# EAGLE design NAQM_Node1 (EAGLE 9.5.2)
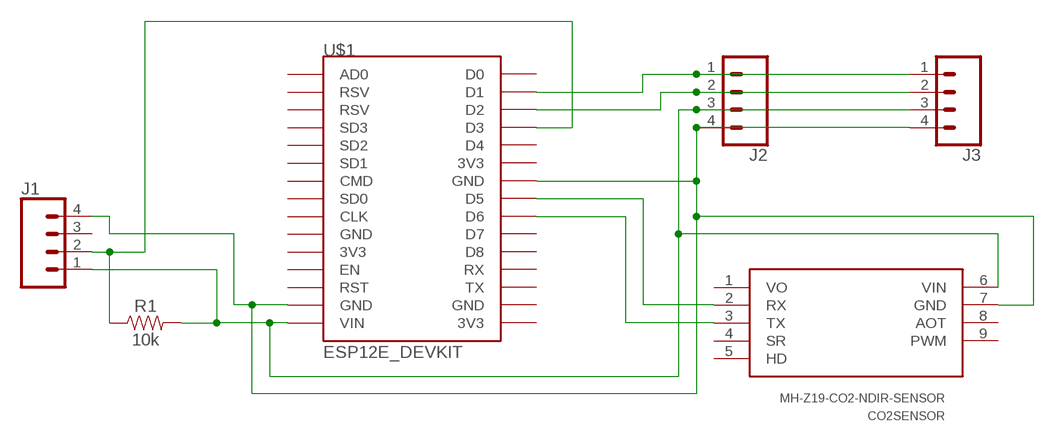
[diagram p0: schematic, sheet 1]

## Parts
CO2SENSOR  MH-Z19-CO2-NDIR-SENSOR  [MH-Z19]
J1  CONN_04PTH  [1X04]
J2  CONN_04PTH  [1X04]
J3  CONN_04PTH  [1X04]
R1  10k  10KOHM-HORIZ-1/4W-1%  [AXIAL-0.3]
U$1  ESP12E_DEVKIT  [ESP12E_DEVKIT]

## Nets
N$1: J2.1 J3.1 U$1.D1
N$2: J2.2 J3.2 U$1.D2
N$4: CO2SENSOR.6(VIN) J1.1 J2.3 J3.3 R1.P$2 U$1.VIN
N$7: J1.2 R1.P$1 U$1.D3
N$8: CO2SENSOR.2(RX) U$1.D5
N$9: CO2SENSOR.3(TX) U$1.D6
N$11: CO2SENSOR.7(GND) J1.4 J2.4 J3.4 U$1.GND@1(GND) U$1.GND@2(GND)
Unconnected: CO2SENSOR.4(SR) CO2SENSOR.5(HD) CO2SENSOR.8(AOT) CO2SENSOR.9(PWM) J1.3 U$1.3V3@0(3V3) U$1.3V3@1(3V3) U$1.3V3@2(3V3) U$1.AD0 U$1.CLK U$1.CMD U$1.D0 U$1.D4 U$1.D7 U$1.D8 U$1.EN U$1.GND@0(GND) U$1.GND@3(GND) U$1.RST U$1.RSV@0(RSV) U$1.RSV@1(RSV) U$1.RX U$1.SD0 U$1.SD1 U$1.SD2 U$1.SD3 U$1.TX

## Power pins joined to a net without a drawn wire
VO: CO2SENSOR.1(VO)

## Library data of the parts
CO2SENSOR = mh-z19:MH-Z19: MH-Z19 - CO2 NDIR SENSOR
J1-J3 = SparkFun-Connectors:CONN_04: Multi connection point. Often used as Generic Header-pin footprint for 0.1 inch spaced/style header connections On any of the 0.1 inch spaced packages, you can populate with these: Break Away Headers - Straight <https://www.sparkfun.com/products/116> (PRT-00116) Break Away Male Headers - Right Angle <https://www.sparkfun.com/products/553> (PRT-00553) Female Headers <https://www.sparkfun.com/products/115> (PRT-00115) Break Away Headers - Machine Pin <https://www.sparkfun.com/products/117> (PRT-00117) Break Away Female Headers - Swiss Machine Pin <https://www.sparkfun.com/products/743> (PRT-00743) For SCREWTERMINALS and SPRING TERMINALS visit here: Screw Terimnals on SparkFun.com <https://www.sparkfun.com/search/results?term=Screw+Terminals> (5mm/3.5mm/2.54mm spacing) This device is also useful as a general connection point to wire up your design to another part of your project. Our various solder wires solder well into these plated through hole pads. Hook-Up Wire - Assortment (Stranded, 22 AWG) <https://www.sparkfun.com/products/11375> (PRT-11375) Hook-Up Wire - Assortment (Solid Core, 22 AWG) <https://www.sparkfun.com/products/11367> (PRT-11367) View the entire wire category on our website here <https://www.sparkfun.com/categories/141> Special notes: Molex polarized connector foot print use with SKU : PRT-08231 with associated crimp pins and housings. 1MM SMD Version SKU: PRT-10208; PROD_ID: CONN-09696
R1 = SparkFun-Resistors:10KOHM: 10kΩ resistor A resistor is a passive two-terminal electrical component that implements electrical resistance as a circuit element. Resistors act to reduce current flow, and, at the same time, act to lower voltage levels within circuits. - Wikipedia; PROD_ID: RES-12183
U$1 = ESP12E_DEVKIT:ESP12E_DEVKIT: ESP12E DEVKIT BOARD

## Board
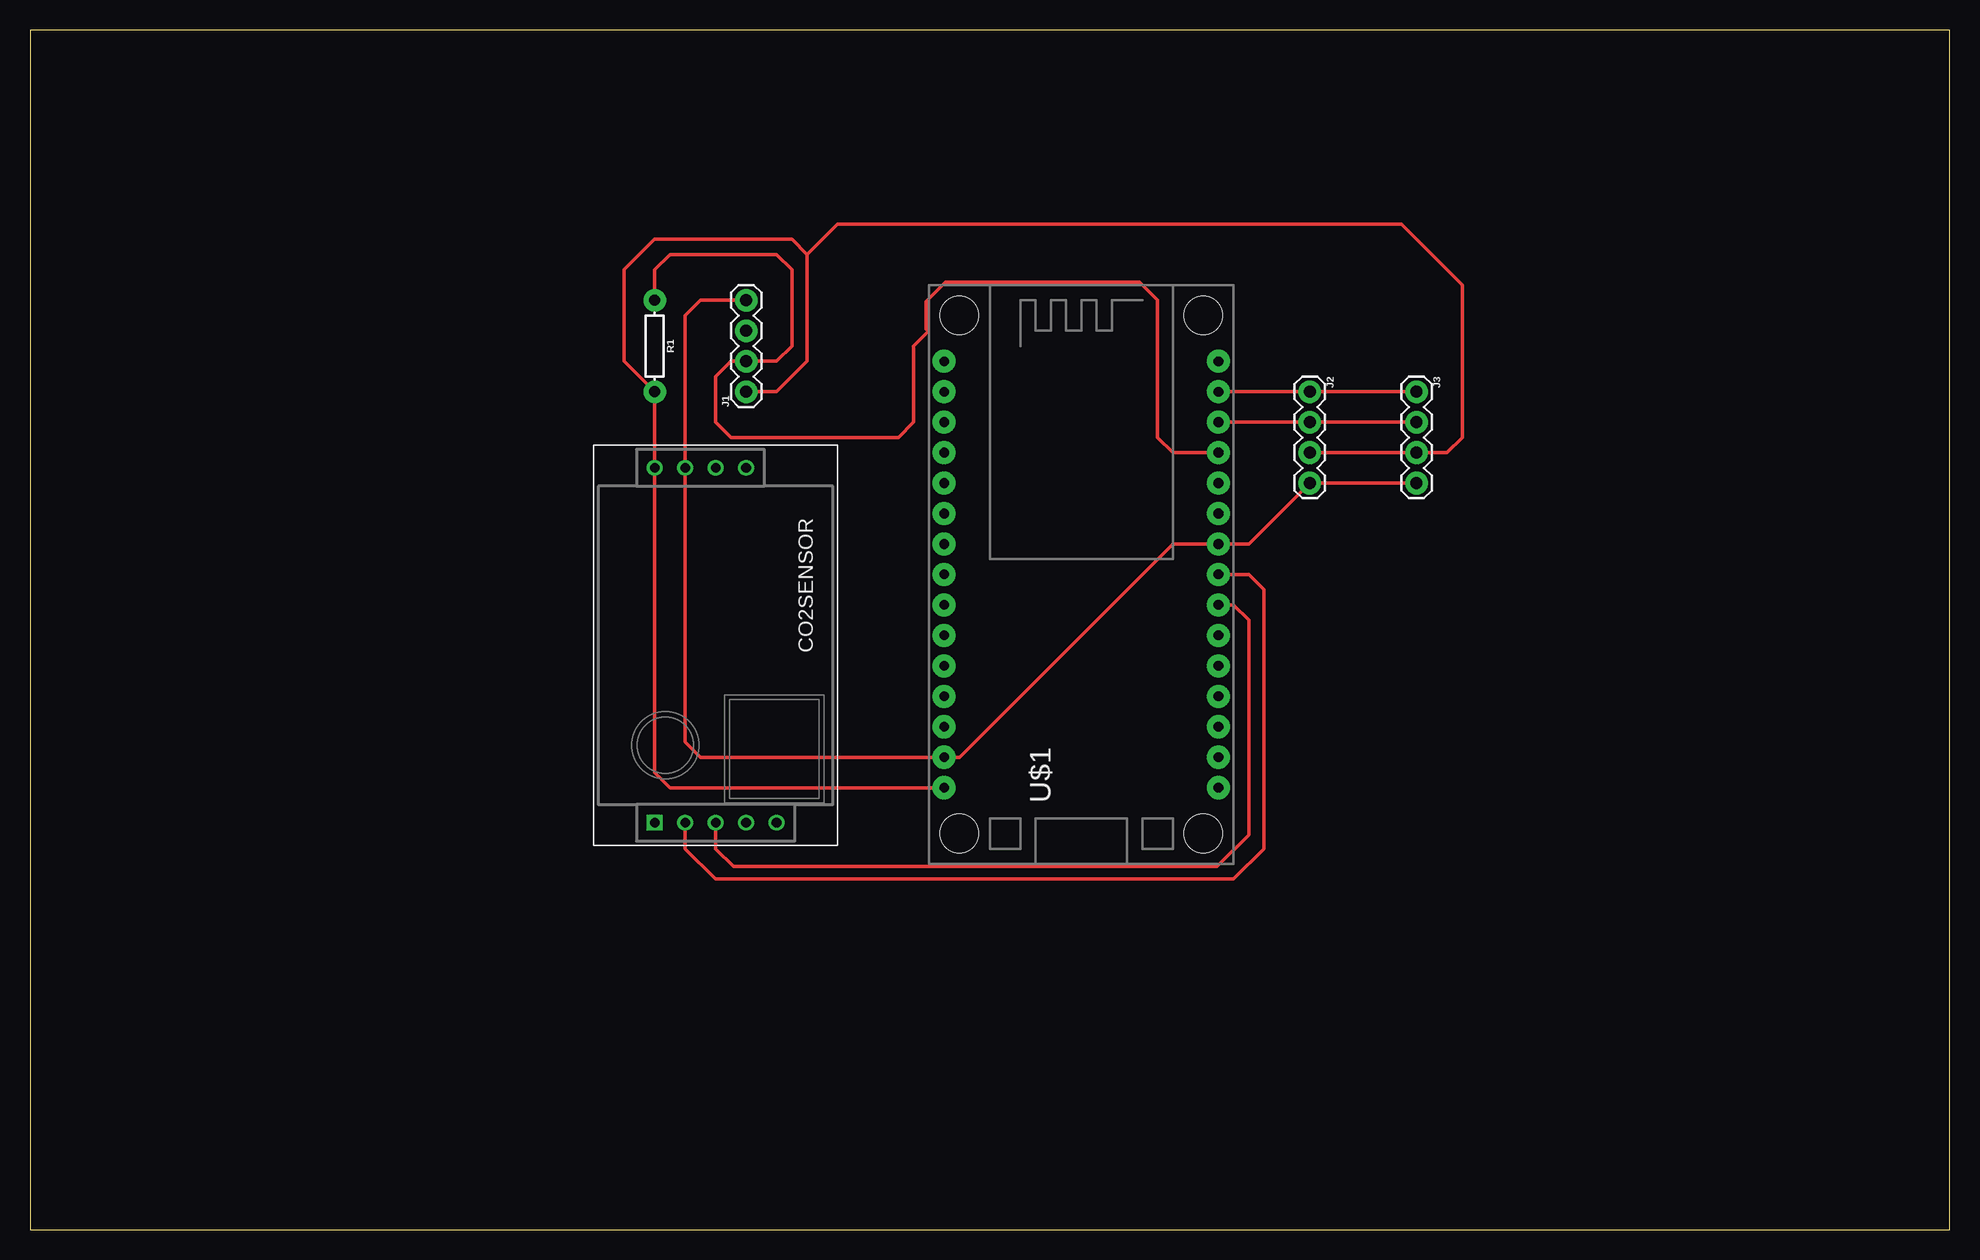
[diagram p1: board, top side]

Size 160 x 100 mm. Coordinates in mm from the lower left corner, seen from the top.
Outline: 0,0 160,0 160,100 0,100 0,0
Copper layers (1*16): Top 0.035mm / dielectric 1.5mm / Bottom 0.035mm
Design rules "default": minimum track width 6mil, minimum drill 0.35mm, track to track 6mil, track to pad 6mil, pad to pad 6mil, via to via 6mil, smd to smd 6mil, copper to edge 40mil, drill to drill 6mil, minimum pad ring 10mil, minimum via ring 8mil, stop-mask expansion 4mil, vias tented up to drill 0mil, thermal gap 10mil

### Footprints (pad centres in the part's own frame; a part is rotated, then mirrored left to right if it is on the bottom)
MH-Z19 = drill 0.8 square: 1 29.591,0 | drill 0.8: 2 29.591,2.54; 3 29.591,5.08; 4 29.591,7.62; 5 29.591,10.16; 6 0,0; 7 0,2.54; 8 0,5.08; 9 0,7.62
1X04 = drill 1.016 pad 1.88: 1 0,0; 2 2.54,0; 3 5.08,0; 4 7.62,0
AXIAL-0.3 = drill 0.9 pad 1.88: P$1 -3.81,0; P$2 3.81,0
ESP12E_DEVKIT = drill 0.8 pad 1.93: 3V3@0 -11.43,-7.62; 3V3@1 11.43,5.08; 3V3@2 11.43,-17.78; AD0 -11.43,17.78; CLK -11.43,-2.54; CMD -11.43,2.54; D0 11.43,17.78; D1 11.43,15.24; D2 11.43,12.7; D3 11.43,10.16; D4 11.43,7.62; D5 11.43,0; D6 11.43,-2.54; D7 11.43,-5.08; D8 11.43,-7.62; EN -11.43,-10.16; GND@0 -11.43,-5.08; GND@1 -11.43,-15.24; GND@2 11.43,2.54; GND@3 11.43,-15.24; RST -11.43,-12.7; RSV@0 -11.43,15.24; RSV@1 -11.43,12.7; RX 11.43,-10.16; SD0 -11.43,0; SD1 -11.43,5.08; SD2 -11.43,7.62; SD3 -11.43,10.16; TX 11.43,-12.7; VIN -11.43,-17.78 | hole 3.2: -10.16,21.59; 10.16,21.59; 10.16,-21.59; -10.16,-21.59

### Placement (x,y rotation side)
CO2SENSOR  52.07,63.5 270 top
J1  59.69,69.85 90 top
J2  106.68,69.85 270 top
J3  115.57,69.85 270 top
R1  52.07,73.66 270 top
U$1  87.63,54.61 0 top

### Tracks (layer width: path | path; a pad name or v marks a point on that pad's centre or on a via)
N$1
  Top 0.305: U$1.D1 J2.1 J3.1
N$2
  Top 0.305: J3.2 J2.2 U$1.D2
N$4
  Top 0.305: U$1.VIN 53.34,36.83 52.07,38.1 CO2SENSOR.6 R1.P$2 49.53,72.39 49.53,80.01 52.07,82.55 63.5,82.55 64.77,81.28 | 64.77,81.28 64.77,72.39 62.23,69.85 J1.1 | J2.3 J3.3 118.11,64.77 119.38,66.04 119.38,78.74 114.3,83.82 67.31,83.82 64.77,81.28
N$7
  Top 0.305: R1.P$1 52.07,80.01 53.34,81.28 62.23,81.28 63.5,80.01 63.5,73.66 62.23,72.39 J1.2 58.42,72.39 57.15,71.12 57.15,67.31 58.42,66.04 72.39,66.04 73.66,67.31 73.66,73.66 74.88,74.88 74.7,75.05 74.7,77.35 76.32,78.97 92.48,78.97 93.98,77.47 93.98,66.04 95.25,64.77 U$1.D3
N$8
  Top 0.305: CO2SENSOR.2 54.61,31.75 57.15,29.21 100.33,29.21 102.87,31.75 102.87,53.34 101.6,54.61 U$1.D5
N$9
  Top 0.305: U$1.D6 100.33,52.07 101.6,50.8 101.6,32.91 98.94,30.25 58.65,30.25 57.15,31.75 CO2SENSOR.3
N$11
  Top 0.305: J1.4 55.88,77.47 54.61,76.2 CO2SENSOR.7 54.61,40.64 55.88,39.37 U$1.GND@1 77.47,39.37 95.25,57.15 U$1.GND@2 101.6,57.15 J2.4 J3.4